# Altium schematic sheet Breakout.SchDoc
size A; Organization: Machine Intelligence Laboratory; Address1: 1889 Museum Rd; Address2: Room 3001; Address3: Gainesville, FL, 32611; Revision: A; SheetNumber: 1; SheetTotal: 1; Author1: Yovany Molina; Author2: Blake Sanders; ENG_APP_DATE: --/--/--; DSN_APP_DATE: --/--/--; CHK_APP_DATE: --/--/--
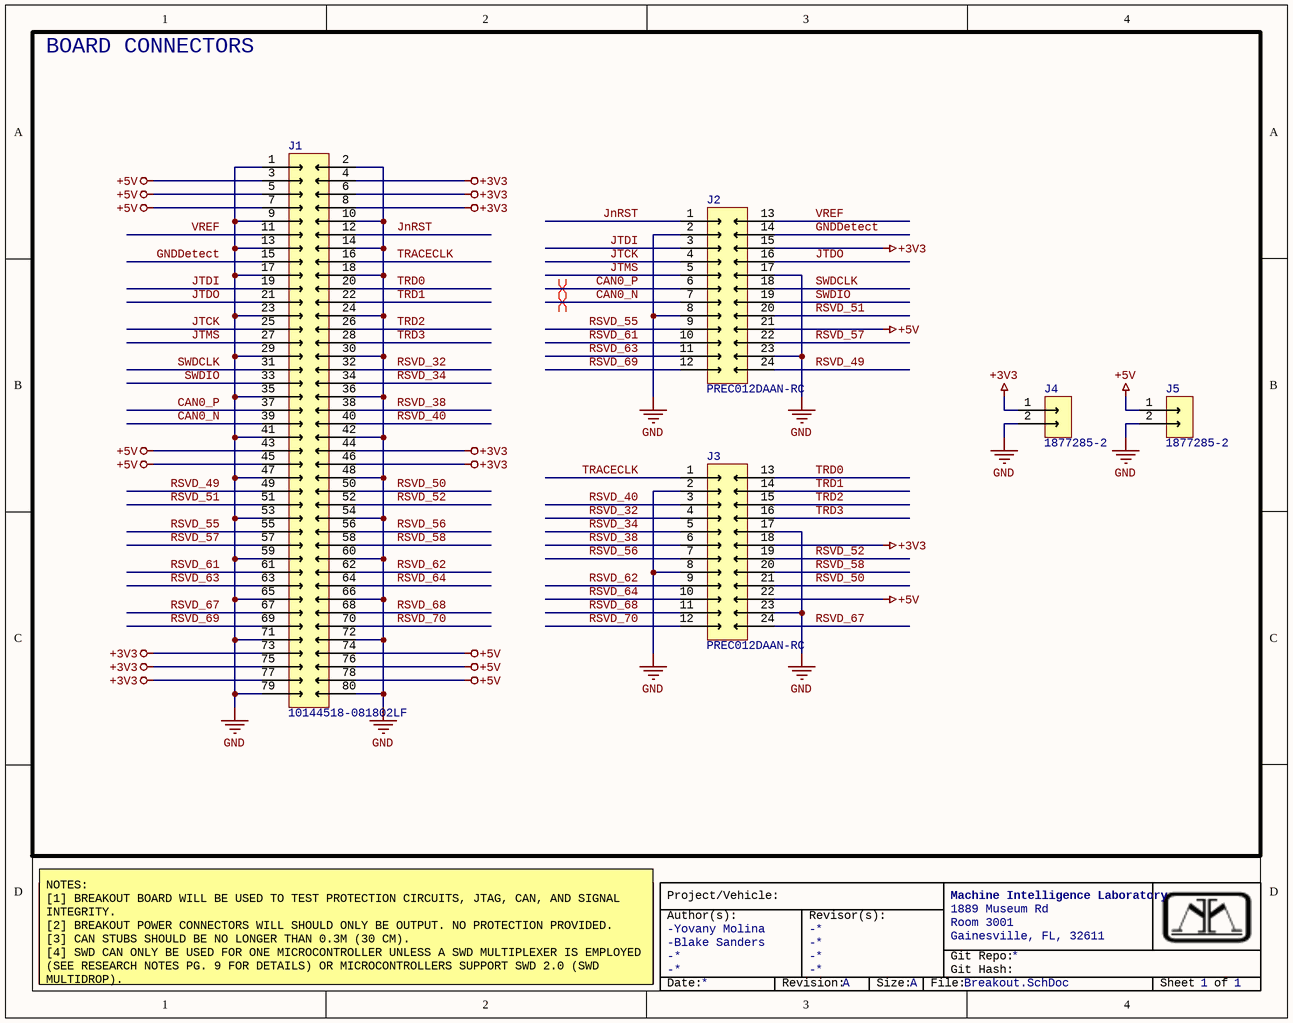
[diagram p0: Breakout.SchDoc]

## Parts
J1  10144518-081802LF  [AMPHENOL_10144518-081802LF]
J2  PREC012DAAN-RC  [PREC012DAAN-RC]
J3  PREC012DAAN-RC  [PREC012DAAN-RC]
J4  1877285-2  [TE_1877285-2]
J5  1877285-2  [TE_1877285-2]

## Blocks framed on the sheet
BOARD CONNECTORS: J1-J5

## Nets
+3V3: J1.4 J1.6 J1.8 J1.44 J1.46 J1.73 J1.75 J1.77 J2.15 J3.18 J4.1
+5V: J1.3 J1.5 J1.7 J1.43 J1.45 J1.74 J1.76 J1.78 J2.21 J3.22 J5.1
GND: J1.1 J1.2 J1.9 J1.10 J1.13 J1.14 J1.17 J1.18 J1.23 J1.24 J1.29 J1.30 J1.35 J1.36 J1.41 J1.42 J1.47 J1.48 J1.53 J1.54 J1.59 J1.60 J1.65 J1.66 J1.71 J1.72 J1.79 J1.80 J2.2 J2.8 J2.17 J2.23 J3.2 J3.8 J3.17 J3.23 J4.2 J5.2
CAN0_N: J1.39 J2.7
CAN0_P: J1.37 J2.6
GNDDetect: J1.15 J2.14
JnRST: J1.12 J2.1
JTCK: J1.25 J2.4
JTDI: J1.19 J2.3
JTDO: J1.21 J2.16
JTMS: J1.27 J2.5
RSVD_32: J1.32 J3.4
RSVD_34: J1.34 J3.5
RSVD_38: J1.38 J3.6
RSVD_40: J1.40 J3.3
RSVD_49: J1.49 J2.24
RSVD_50: J1.50 J3.21
RSVD_51: J1.51 J2.20
RSVD_52: J1.52 J3.19
RSVD_55: J1.55 J2.9
RSVD_56: J1.56 J3.7
RSVD_57: J1.57 J2.22
RSVD_58: J1.58 J3.20
RSVD_61: J1.61 J2.10
RSVD_62: J1.62 J3.9
RSVD_63: J1.63 J2.11
RSVD_64: J1.64 J3.10
RSVD_67: J1.67 J3.24
RSVD_68: J1.68 J3.11
RSVD_69: J1.69 J2.12
RSVD_70: J1.70 J3.12
SWDCLK: J1.31 J2.18
SWDIO: J1.33 J2.19
TRACECLK: J1.16 J3.1
TRD0: J1.20 J3.13
TRD1: J1.22 J3.14
TRD2: J1.26 J3.15
TRD3: J1.28 J3.16
VREF: J1.11 J2.13

## Layout directives
differential pair; rule Matched Net Lengths [Tolerance = 5mil]; rule Differential Pairs Routing [Pref Gap = 10mil    Min Gap  = 10mil    Max Gap  = 10milPref Width = 15mil    Min Width  = 15mil    Max Width  = 15mil]; net class CAN0; differential pair class CAN0_LINES: CAN0_N, CAN0_P

## Notes on the sheet
- NOTES:
  [1] BREAKOUT BOARD WILL BE USED TO TEST PROTECTION CIRCUITS, JTAG, CAN, AND SIGNAL INTEGRITY.
  [2] BREAKOUT POWER CONNECTORS WILL SHOULD ONLY BE OUTPUT. NO PROTECTION PROVIDED.
  [3] CAN STUBS SHOULD BE NO LONGER THAN 0.3M (30 CM).
  [4] SWD CAN ONLY BE USED FOR ONE MICROCONTROLLER UNLESS A SWD MULTIPLEXER IS EMPLOYED (SEE RESEARCH NOTES PG. 9 FOR DETAILS) OR MICROCONTROLLERS SUPPORT SWD 2.0 (SWD MULTIDROP).
  [5] IT IS RECOMMENDED TO ROUTE TDI AND TDO SEPARATED BY A GROUND PLANE/WIRE.
- Project/Vehicle:
- PLACE NOTES BOX HERE
- Author(s):
- -
- Revisor(s):
- Git Repo:
- Git Hash:
- Date:
- Revision:
- Size:
- A
- File:
- Sheet
- of

## Library data of the parts
J1 = 10144518-081802LF: CONN PLUG 1 80POS SMD GOLD; System: Connector; Supplier 1: Digikey; Supplier Part Number 1: 609-5453-1-ND
J2 J3 = PREC012DAAN-RC: Connector Header Through Hole 24 position 0.100" (2.54mm); Supplier 1: Digikey; Supplier Part Number 1: S2012EC-12-ND
J4 J5 = 1877285-2: Supplier 1: Digi-Key; Supplier Part Number 1: A99845-ND